# EAGLE design RN4020_BLE_V1 (EAGLE 7.4.0)
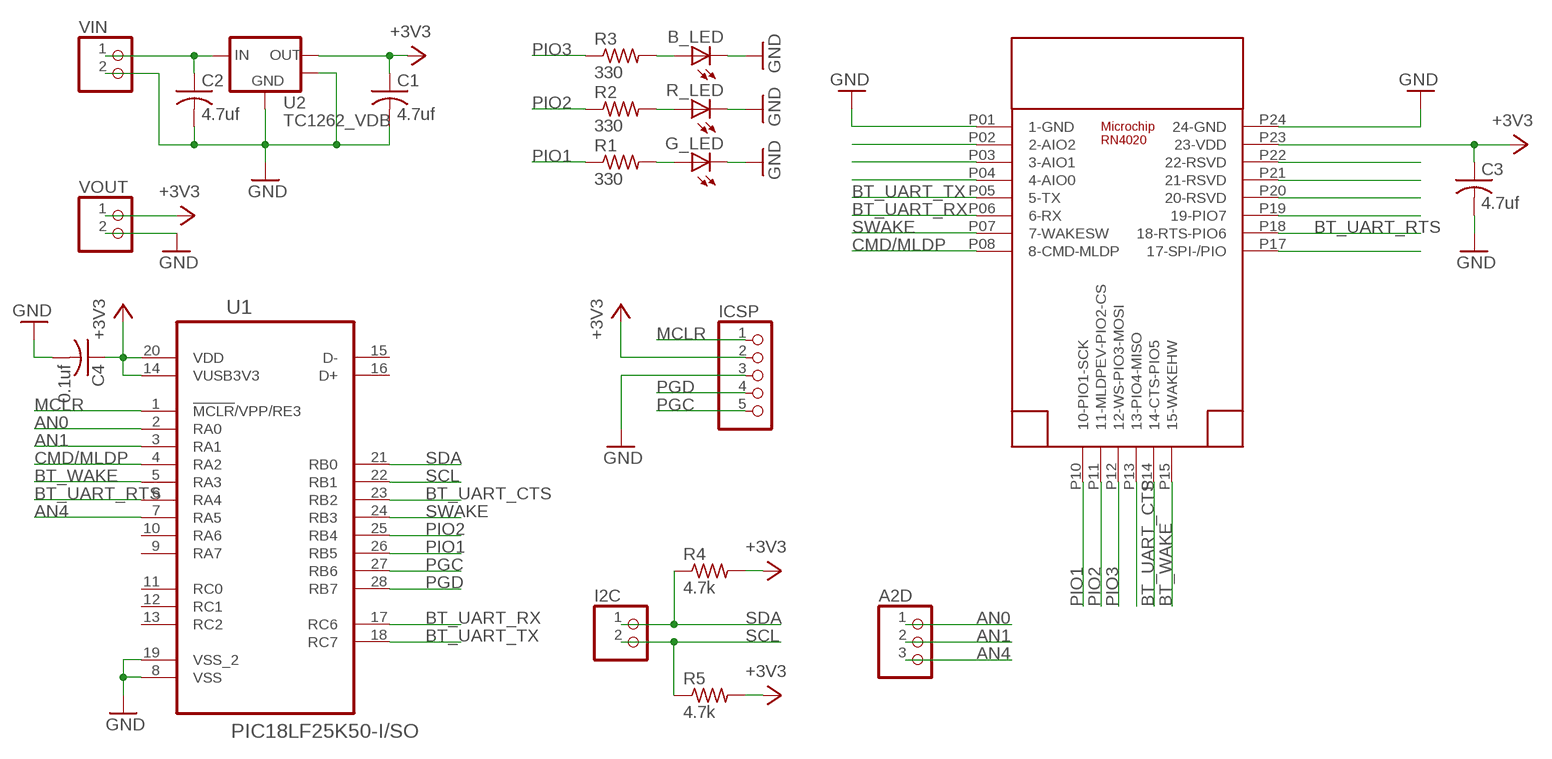
[diagram p0: schematic, sheet 1]

## Parts
A2D  PINHD-1X3  [1X03]
B_LED  LEDSMT1206  [1206]
C1  4.7uf  C-USC1206  [C1206]
C2  4.7uf  C-USC1206  [C1206]
C3  4.7uf  C-USC1206  [C1206]
C4  0.1uf  C-USC1206  [C1206]
G_LED  LEDSMT1206  [1206]
I2C  PINHD-1X2  [1X02]
ICSP  PINHD-1X5  [1X05]
R1  330  R-US_R1206  [R1206]
R2  330  R-US_R1206  [R1206]
R3  330  R-US_R1206  [R1206]
R4  4.7k  R-US_R1206  [R1206]
R5  4.7k  R-US_R1206  [R1206]
R_LED  LEDSMT1206  [1206]
U1  PIC18LF25K50-I/SO  [SOIC127P1032X265-28N]
U2  TC1262_VDB  [SOT-223-3]
U$1  RN4020  [RN4020SMD]
VIN  PINHD-1X2  [1X02]
VOUT  PINHD-1X2  [1X02]

## Nets
+3V3: C1.1 C3.1 C4.1 ICSP.2 R4.2 R5.2 U1.14(VUSB3V3) U1.20(VDD) U2.3(VOUT) U$1.P23(23-VDD) VOUT.1
AN0: A2D.1 U1.2(RA0)
AN1: A2D.2 U1.3(RA1)
AN4: A2D.3 U1.7(RA5)
BT_UART_CTS: U1.23(RB2) U$1.P14(14-CTS-PIO5)
BT_UART_RTS: U1.6(RA4) U$1.P18(18-RTS-PIO6)
BT_UART_RX: U1.17(RC6) U$1.P06(6-RX)
BT_UART_TX: U1.18(RC7) U$1.P05(5-TX)
BT_WAKE: U1.5(RA3) U$1.P15(15-WAKEHW)
CMD/MLDP: U1.4(RA2) U$1.P08(8-CMD-MLDP)
GND: B_LED.C C1.2 C2.2 C3.2 C4.2 G_LED.C ICSP.3 R_LED.C U1.8(VSS) U1.19(VSS_2) U2.2(GND) U2.4(TAB) U$1.P01(1-GND) U$1.P24(24-GND) VIN.2 VOUT.2
MCLR: ICSP.1 U1.1(!MCLR!/VPP/RE3)
N$1: G_LED.A R1.2
N$2: R2.2 R_LED.A
N$3: B_LED.A R3.2
N$4: C2.1 U2.1(VIN) VIN.1
N$6: U$1.P02(2-AIO2)
N$7: U$1.P03(3-AIO1)
N$8: U$1.P04(4-AIO0)
N$12: U$1.P13(13-PIO4-MISO)
N$13: U$1.P17(17-SPI-/PIO)
N$14: U$1.P19(19-PIO7)
N$15: U$1.P20(20-RSVD)
N$16: U$1.P21(21-RSVD)
N$17: U$1.P22(22-RSVD)
PGC: ICSP.5 U1.27(RB6)
PGD: ICSP.4 U1.28(RB7)
PIO1: R1.1 U1.26(RB5) U$1.P10(10-PIO1-SCK)
PIO2: R2.1 U1.25(RB4) U$1.P11(11-MLDPEV-PIO2-CS)
PIO3: R3.1 U$1.P12(12-WS-PIO3-MOSI)
SCL: I2C.2 R5.1 U1.22(RB1)
SDA: I2C.1 R4.1 U1.21(RB0)
SWAKE: U1.24(RB3) U$1.P07(7-WAKESW)
Unconnected: U1.9(RA7) U1.10(RA6) U1.11(RC0) U1.12(RC1) U1.13(RC2) U1.15(D-) U1.16(D+)

## Library data of the parts
A2D = pinhead:PINHD-1X3: PIN HEADER
B_LED G_LED R_LED = led:LED: LED OSRAM: - CHIPLED LG R971, LG N971, LY N971, LG Q971, LY Q971, LO R971, LY R971 LH N974, LH R974 LS Q976, LO Q976, LY Q976 LO Q996 - Hyper CHIPLED LW Q18S LB Q993, LB Q99A, LB R99A - SideLED LS A670, LO A670, LY A670, LG A670, LP A670 LB A673, LV A673, LT A673, LW A673 LH A674 LY A675 LS A676, LA A676, LO A676, LY A676, LW A676 LS A679, LY A679, LG A679 - Hyper Micro SIDELED® LS Y876, LA Y876, LO Y876, LY Y876 LT Y87S - SmartLED LW L88C, LW L88S LB L89C, LB L89S, LG L890 LS L89K, LO L89K, LY L89K LS L896, LA L896, LO L896, LY L896 - TOPLED LS T670, LO T670, LY T670, LG T670, LP T670 LSG T670, LSP T670, LSY T670, LOP T670, LYG T670 LG T671, LOG T671, LSG T671 LB T673, LV T673, LT T673, LW T673 LH T674 LS T676, LA T676, LO T676, LY T676, LB T676, LH T676, LSB T676, LW T676 LB T67C, LV T67C, LT T67C, LS T67K, LO T67K, LY T67K, LW E67C LS E67B, LA E67B, LO E67B, LY E67B, LB E67C, LV E67C, LT E67C LW T67C LS T679, LY T679, LG T679 LS T770, LO T770, LY T770, LG T770, LP T770 LB T773, LV T773, LT T773, LW T773 LH T774 LS E675, LA E675, LY E675, LS T675 LS T776, LA T776, LO T776, LY T776, LB T776 LHGB T686 LT T68C, LB T68C - Hyper Mini TOPLED® LB M676 - Mini TOPLED Santana® LG M470 LS M47K, LO M47K, LY M47K Source: http://www.osram.convergy.de LUXEON: - LUMILED® LXK2-PW12-R00, LXK2-PW12-S00, LXK2-PW14-U00, LXK2-PW14-V00 LXK2-PM12-R00, LXK2-PM12-S00, LXK2-PM14-U00 LXK2-PE12-Q00, LXK2-PE12-R00, LXK2-PE12-S00, LXK2-PE14-T00, LXK2-PE14-U00 LXK2-PB12-K00, LXK2-PB12-L00, LXK2-PB12-M00, LXK2-PB14-N00, LXK2-PB14-P00, LXK2-PB14-Q00 LXK2-PR12-L00, LXK2-PR12-M00, LXK2-PR14-Q00, LXK2-PR14-R00 LXK2-PD12-Q00, LXK2-PD12-R00, LXK2-PD12-S00 LXK2-PH12-R00, LXK2-PH12-S00 LXK2-PL12-P00, LXK2-PL12-Q00, LXK2-PL12-R00 Source: www.luxeon.com KINGBRIGHT: KA-3528ASYC Source: www.kingbright.com
C1-C4 = resistor:C-US: CAPACITOR, American symbol
I2C VIN VOUT = pinhead:PINHD-1X2: PIN HEADER
ICSP = pinhead:PINHD-1X5: PIN HEADER
R1-R5 = resistor:R-US_: RESISTOR, American symbol
U1 = mcmurrough:PIC18LF25K50-I/SO: IC, MCU, 8BIT, 32KB FLASH, 28SOIC; MPN: PIC18LF25K50-I/SO; OC_FARNELL: 2305843; OC_NEWARK: 06W3032; PACKAGE: 28SOIC; SUPPLIER: Microchip
U2 = bt_regulator:TC1262: Microchip TC1262 LDO Regulator The TC1262 is a fixed output, high accuracy (typically ±0.5%) CMOS low dropout regulator. Designed specif- ically for battery-operated systems, the TC1262’s CMOS construction eliminates wasted ground current, significantly extending battery life. Total supply current is typically 80A at full load (20 to 60 times lower than in bipolar regulators). TC1262 key features include ultra low noise operation, very low dropout voltage (typically 350mV at full load), and fast response to step changes in load. Datasheet.pdf <http://ww1.microchip.com/downloads/en/DeviceDoc/21373C.pdf>
U$1 = microchip_bluetooth_v101:RN4020

## Board
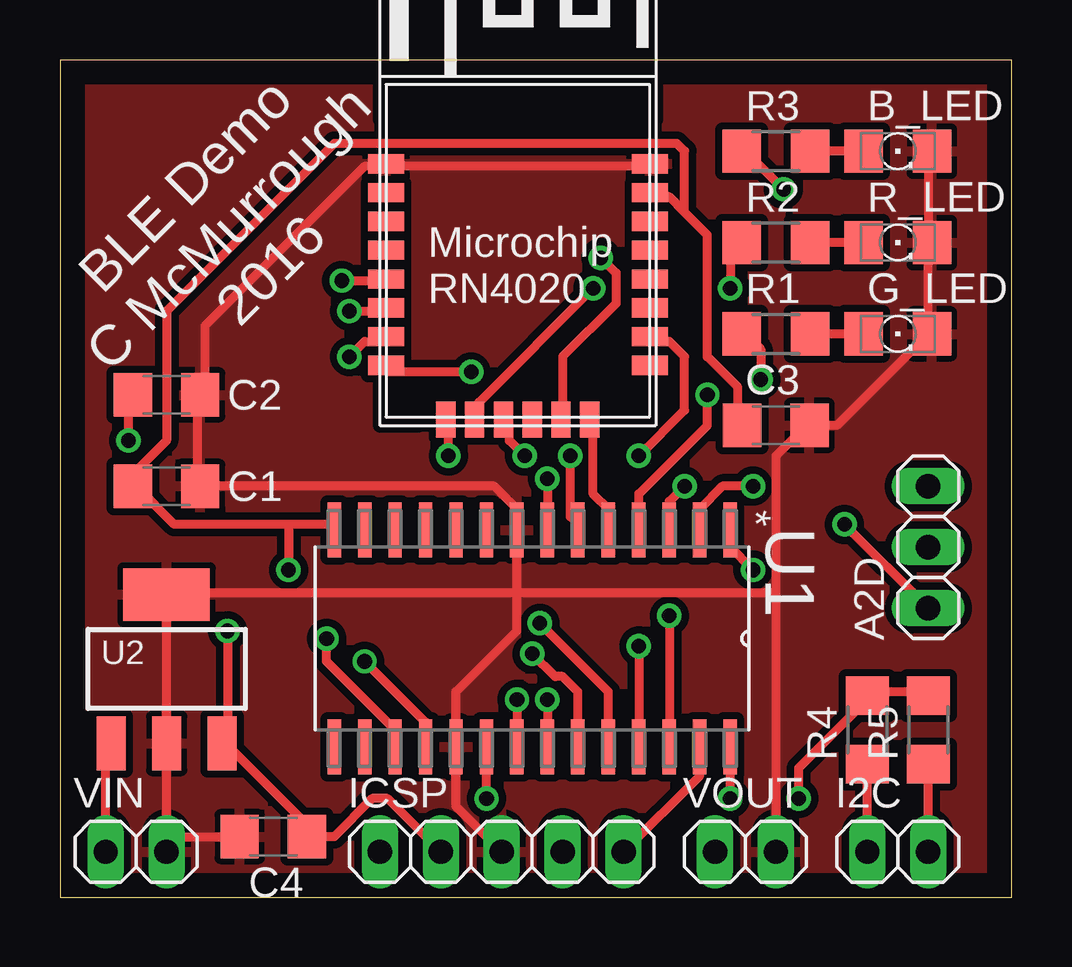
[diagram p1: board, top side]
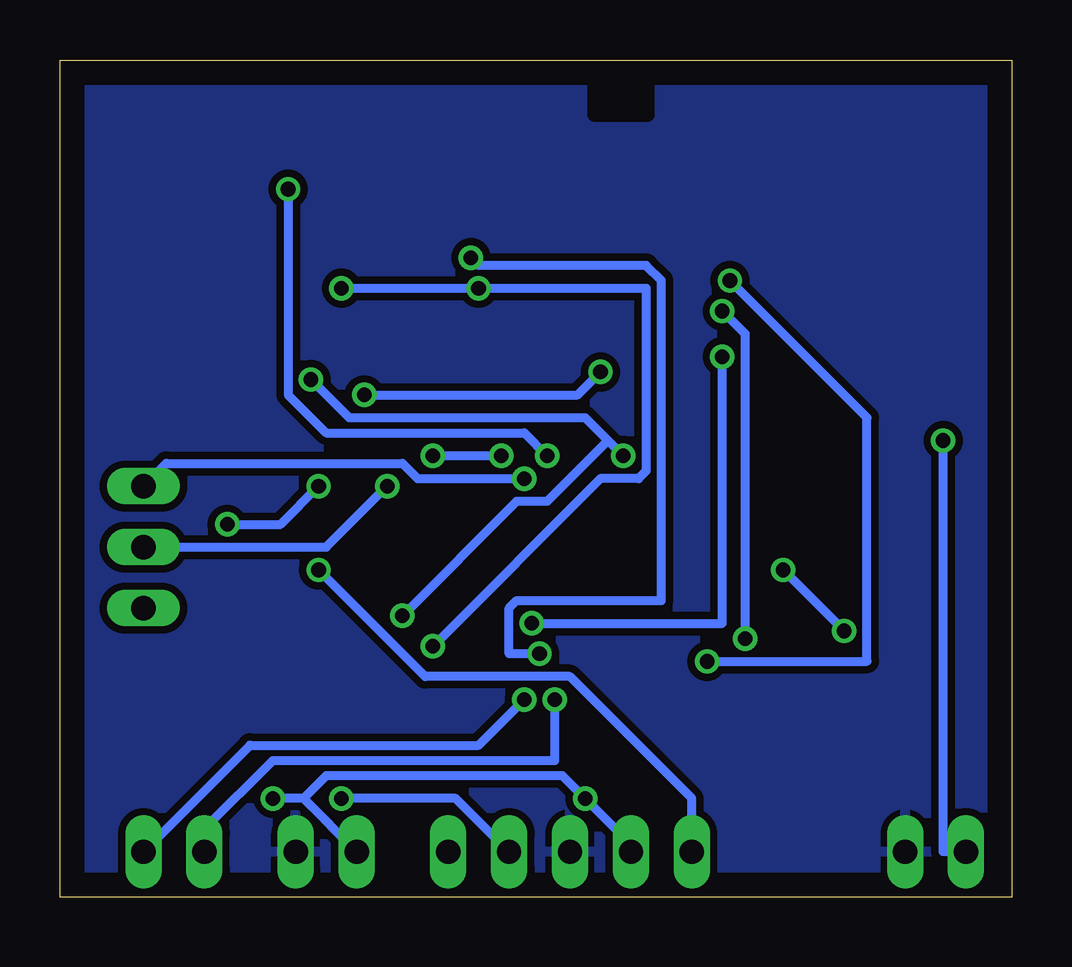
[diagram p2: board, bottom side, seen from below]

Size 39.67 x 34.91 mm. Coordinates in mm from the lower left corner, seen from the top.
Outline: 0,0 39.67,0 39.67,34.91 0,34.91 0,0
Copper layers (1*16): Top 0.035mm / dielectric 1.5mm / Bottom 0.035mm
Design rules "default *": minimum track width 15mil, minimum drill 24mil, track to track 8mil, track to pad 8mil, pad to pad 8mil, via to via 8mil, smd to smd 8mil, copper to edge 40mil, drill to drill 8mil, minimum pad ring 10mil, minimum via ring 8mil, stop-mask expansion 4mil, vias tented up to drill 0mil, thermal gap 10mil

### Footprints (pad centres in the part's own frame; a part is rotated, then mirrored left to right if it is on the bottom)
1X03 = drill 1.016 long: 1 -2.54,0; 2 0,0; 3 2.54,0
1206 = smd 1.6 x 1.803: A -1.422,0; C 1.422,0
C1206 = smd 1.6 x 1.8: 1 -1.4,0; 2 1.4,0
1X02 = drill 1.016 long: 1 -1.27,0; 2 1.27,0
1X05 = drill 1.016 long: 1 -5.08,0; 2 -2.54,0; 3 0,0; 4 2.54,0; 5 5.08,0
R1206 = smd 1.6 x 1.803: 1 -1.422,0; 2 1.422,0
SOIC127P1032X265-28N = smd 2.286 x 0.559: 1 -4.521,8.255; 2 -4.521,6.985; 3 -4.521,5.715; 4 -4.521,4.445; 5 -4.521,3.175; 6 -4.521,1.905; 7 -4.521,0.635; 8 -4.521,-0.635; 9 -4.521,-1.905; 10 -4.521,-3.175; 11 -4.521,-4.445; 12 -4.521,-5.715; 13 -4.521,-6.985; 14 -4.521,-8.255; 15 4.521,-8.255; 16 4.521,-6.985; 17 4.521,-5.715; 18 4.521,-4.445; 19 4.521,-3.175; 20 4.521,-1.905; 21 4.521,-0.635; 22 4.521,0.635; 23 4.521,1.905; 24 4.521,3.175; 25 4.521,4.445; 26 4.521,5.715; 27 4.521,6.985; 28 4.521,8.255
SOT-223-3 = smd 1.219 x 2.235: 1 -2.311,-3.099; 2 0,-3.099; 3 2.311,-3.099 | smd 3.6 x 2.2: 4 0,3.099
RN4020SMD = smd 1.5 x 0.8: P01 0.25,10.9; P02 0.25,9.7; P03 0.25,8.5; P04 0.25,7.3; P05 0.25,6.1; P06 0.25,4.9; P07 0.25,3.7; P08 0.25,2.5; P17 11.25,2.5; P18 11.25,3.7; P19 11.25,4.9; P20 11.25,6.1; P21 11.25,7.3; P22 11.25,8.5; P23 11.25,9.7; P24 11.25,10.9 | smd 0.8 x 1.5: P10 2.75,0.25; P11 3.95,0.25; P12 5.15,0.25; P13 6.35,0.25; P14 7.55,0.25; P15 8.75,0.25

### Placement (x,y rotation side)
A2D  36.2,14.61 90 top
B_LED  34.92,31.12 0 top
C1  4.45,17.15 0 top
C2  4.45,20.96 0 top
C3  29.85,19.69 0 top
C4  8.89,2.54 180 top
G_LED  34.92,23.5 0 top
I2C  34.92,1.91 0 top
ICSP  18.42,1.91 0 top
R1  29.85,23.5 0 top
R2  29.85,27.31 0 top
R3  29.85,31.12 0 top
R4  33.66,6.98 90 top
R5  36.2,6.98 90 top
R_LED  34.92,27.31 0 top
U1  19.69,10.79 270 top
U2  4.45,9.53 0 top
U$1  13.33,19.69 0 top
VIN  3.17,1.91 0 top
VOUT  28.58,1.91 0 top

### Tracks (layer width: path | path; a pad name or v marks a point on that pad's centre or on a via)
+3V3  (via drill 0.61)
  Top 0.381: R5.2 36.2,8.57 33.66,8.57 R4.2 33.66,8.26 30.8,5.4 v30.8,4.13 | v17.78,4.13 U1.20 | ICSP.2 13.65,4.13 13.02,4.13 11.43,2.54 C4.1 10.16,2.54 10.16,3.17 6.98,6.35 U2.3 6.98,6.67 v6.98,11.11 | 3.17,17.15 4.76,15.56 9.53,15.56 | 9.53,15.56 11.43,15.56 U1.14 | 26.04,28.58 26.99,27.62 26.99,22.54 28.26,21.27 28.26,19.69 C3.1 | 26.04,28.58 25.4,29.21 24.77,29.21 U$1.P23 | 3.17,17.15 3.17,17.78 4.45,19.05 4.45,24.45 11.43,31.43 25.72,31.43 26.04,31.12 26.04,28.58 | 3.17,17.15 C1.1 | 9.53,15.56 v9.53,13.65
  Bottom 0.381: 29.53,4.13 v30.8,4.13 | VOUT.1 29.53,4.13 | ICSP.2 15.88,2.22 v17.78,4.13 18.73,5.08 28.58,5.08 29.53,4.13 | v9.53,13.65 v6.98,11.11
AN0  (via drill 0.61)
  Top 0.381: U1.2 26.67,16.19 27.62,17.15 v28.89,17.15 | A2D.1 v32.7,15.56
  Bottom 0.381: v28.89,17.15 30.48,15.56 v32.7,15.56
AN1  (via drill 0.61)
  Top 0.381: U1.3 25.4,16.51 v26.04,17.15
  Bottom 0.381: v26.04,17.15 28.58,14.61 A2D.2
AN4  (via drill 0.61)
  Top 0.381: v20.32,17.46 U1.7
  Bottom 0.381: v20.32,17.46 24.77,17.46 25.4,18.1 35.24,18.1 A2D.3
BT_UART_CTS  (via drill 0.61)
  Top 0.381: v22.54,26.67 23.18,26.04 23.18,24.77 20.96,22.54 20.96,20 U$1.P14 | v19.69,10.16 20.64,9.21 20.96,9.21 21.59,8.57 U1.23
  Bottom 0.381: v22.54,26.67 22.23,26.35 15.24,26.35 14.61,25.72 14.61,12.38 20.64,12.38 20.96,12.06 20.96,10.16 v19.69,10.16
BT_UART_RTS  (via drill 0.61)
  Top 0.381: v24.13,18.42 26.04,20.32 26.04,22.54 25.4,23.18 24.77,23.18 U$1.P18 | v21.27,18.42 21.27,15.88 21.59,15.56 U1.6
  Bottom 0.381: v21.27,18.42 v24.13,18.42
BT_UART_RX  (via drill 0.61)
  Top 0.381: v12.06,24.45 13.33,24.45 U$1.P06 | v11.11,10.79 11.11,9.84 13.97,6.98 U1.17
  Bottom 0.381: v12.06,24.45 11.11,23.5 v11.11,10.79
BT_UART_TX  (via drill 0.61)
  Top 0.381: v11.75,25.72 13.33,25.72 U$1.P05 | v12.7,9.84 15.24,7.3 U1.18
  Bottom 0.381: v11.75,25.72 6.03,20 6.03,9.84 v12.7,9.84
BT_WAKE
  Top 0.381: U1.5 22.86,16.19 22.23,16.83 22.23,19.69 U$1.P15
CMD/MLDP  (via drill 0.61)
  Top 0.381: v17.15,21.91 13.65,21.91 U$1.P08 | v26.99,20.96 26.99,19.69 24.13,16.83 U1.4
  Bottom 0.381: v17.15,21.91 18.1,20.96 v26.99,20.96
GND
  Top 0.381: U$1.P24 24.45,30.48 13.65,30.48 U$1.P01 13.33,30.48 12.7,30.48 6.03,23.81 6.03,20.96 C2.2 5.71,20.96 5.71,17.15 C1.2 18.1,17.15 19.05,16.19 U1.8 19.05,12.7 | C4.2 5.08,2.54 VIN.2 U2.2 U2.4 4.45,12.7 19.05,12.7 | ICSP.3 16.51,3.81 U1.19 16.51,8.57 19.05,11.11 19.05,12.7 | 36.2,27.31 36.2,31.12 B_LED.C | 36.2,23.5 32.38,19.69 C3.2 31.12,19.69 29.85,18.42 29.85,12.7 | 29.85,12.7 VOUT.2 | 36.2,23.5 36.2,27.31 | 36.2,27.31 R_LED.C | 36.2,23.5 G_LED.C | 29.85,12.7 19.05,12.7
  pour Top (isolate 0.305): 0,34.92 39.37,34.92 39.37,0 0,0
  pour Bottom (isolate 0.305): 0,34.92 39.37,34.92 39.37,0 0,0
MCLR  (via drill 0.61)
  Top 0.381: U1.1 27.94,14.61 v28.89,13.65
  Bottom 0.381: v28.89,13.65 24.45,9.21 18.42,9.21 13.33,4.13 ICSP.1
N$1
  Top 0.381: G_LED.A R1.2
N$2
  Top 0.381: R_LED.A R2.2
N$3
  Top 0.381: B_LED.A R3.2
N$4  (via drill 0.61)
  Top 0.381: v2.86,19.05 2.86,20.96 C2.1 | VIN.1 1.91,6.35 U2.1
  Bottom 0.381: v2.86,19.05 2.86,1.91 VIN.1
PGC
  Top 0.381: U1.27 26.67,5.08 ICSP.5
PGD  (via drill 0.61)
  Top 0.381: v27.94,4.13 U1.28
  Bottom 0.381: v27.94,4.13 23.18,4.13 ICSP.4
PIO1  (via drill 0.61)
  Top 0.381: v16.19,18.42 16.19,19.69 U$1.P10 | v29.21,21.59 29.21,22.86 28.58,23.5 R1.1 | v25.4,11.75 U1.26
  Bottom 0.381: 16.83,19.05 17.78,20 27.62,20 v29.21,21.59 | 16.83,19.05 v16.19,18.42 | v25.4,11.75 20.64,16.51 19.37,16.51 16.83,19.05
PIO2  (via drill 0.61)
  Top 0.381: v22.23,25.4 17.46,20.64 17.46,20 U$1.P11 | v27.94,25.4 27.94,26.99 28.26,27.31 R2.1 | v24.13,10.48 U1.25
  Bottom 0.381: v27.94,25.4 v22.23,25.4 15.24,25.4 15.24,17.78 15.56,17.46 17.15,17.46 v24.13,10.48
PIO3  (via drill 0.61)
  Top 0.381: v19.37,18.42 18.73,19.05 18.73,19.69 U$1.P12 | v30.16,29.53 28.58,31.12 R3.1
  Bottom 0.381: v19.37,18.42 20.32,19.37 28.58,19.37 30.16,20.96 v30.16,29.53
SCL  (via drill 0.61)
  Top 0.381: I2C.2 R5.1 | v20.32,8.26 U1.22
  Bottom 0.381: v20.32,8.26 22.23,6.35 31.75,6.35 I2C.2
SDA  (via drill 0.61)
  Top 0.381: I2C.1 R4.1 | v19.05,8.26 U1.21
  Bottom 0.381: v19.05,8.26 19.05,5.71 30.8,5.71 33.66,2.86 I2C.1
SWAKE  (via drill 0.61)
  Top 0.381: v12.06,22.54 12.7,23.18 13.33,23.18 U$1.P07 | v20,11.43 22.86,8.57 U1.24
  Bottom 0.381: v12.06,22.54 12.06,11.43 v20,11.43

### Text on the board
tPlace: BLE Demo / C McMurrough / 2016